# EasyEDA Pro project 4090_Portable_Fan.epro, board PCB1_3
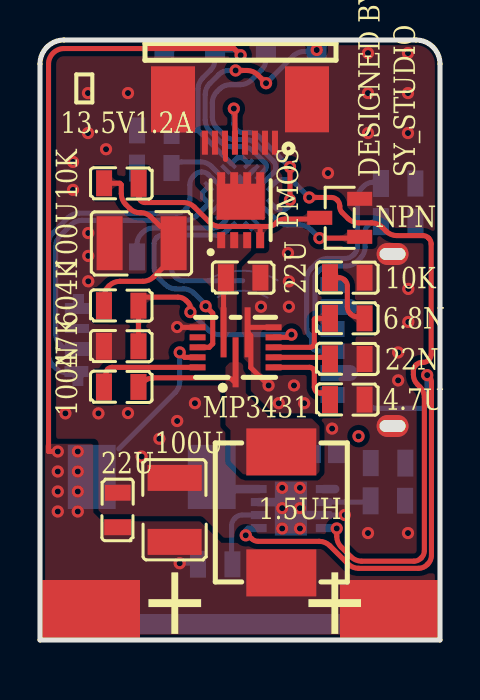
[diagram p6: board, top side]
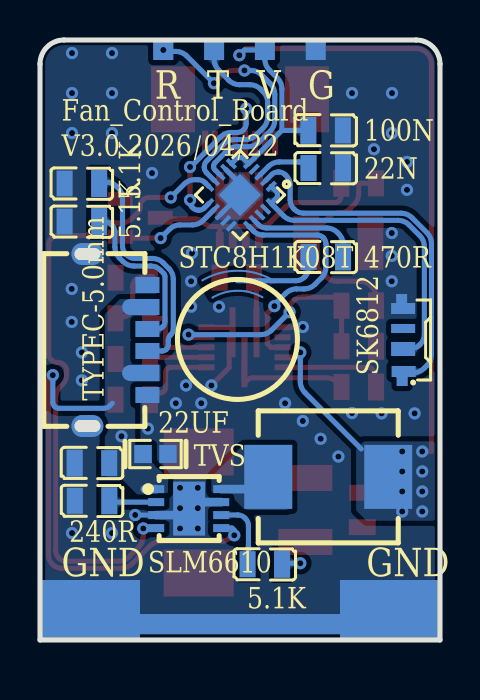
[diagram p7: board, bottom side, seen from below]

Outline 20 x 30 mm; copper layers: Top Layer, Bottom Layer. Coordinates in mm from the lower left corner of the outline.
Outline path: 0,28.8 arc(0.35,29.65) 1.2,30 18.8,30 arc(19.65,29.65) 20,28.8 20,0 0,0 0,28.8
Stack: Top Layer 0.035mm / Dielectric1 1.51mm FR4 er 4.5 / Bottom Layer 0.035mm

## Design rules (mm)
spacing copperThickness1oz (default): track to track 0.102, other pairs 0.152 to 0.3
spacing copperThickness2oz: track to track 0.203, other pairs 0.152 to 0.3
spacing Plane_innerPlane: track to track 0.102, other pairs 0.152 to 0.3
spacing Copper_copperRegion: track to track 0.102, other pairs 0.152 to 0.3
track width copperThickness1oz (default): min 0.127, default 0.254, max 2.54
track width copperThickness2oz: min 0.203, default 0.254, max 2.54
differential pair differentialPair (default): width min 0.127, default 0.254, max 2.54; gap min 0.152, default 0.152
net GND uses copperRegion_copperThickness1oz
net VBUS uses copperRegion_copperThickness1oz
net VBAT uses copperRegion_copperThickness1oz
net 13.5V uses copperRegion_copperThickness1oz
net $1N43239 uses copperRegion_copperThickness1oz
pour e97 uses Copper_copperRegion, copperRegion_Copper_copperRegion
net $1N43301 uses copperRegion_copperThickness1oz
net VFAN uses copperRegion_copperThickness1oz
pour e324 uses Copper_copperRegion, copperRegion_Copper_copperRegion
pour e327 uses Copper_copperRegion, copperRegion_Copper_copperRegion

## Placement (name value [footprint] x y rotation side)
C1  22nF  [0805_S]  5.72 23.65 90 bottom
C2  100uF  [C1210]  5.08 19.84 0 top
C3  22uF  [0805_S]  10.16 18.06 270 top
C5  100uF  [C1210]  6.73 6.5 270 top
C9  22uF  [0805_S]  17.4 8.79 270 bottom
C10  22uF  [0805_S]  3.94 6.5 0 top
C11  4.7uF  [0805_S]  15.37 11.97 270 top
C12  100nF  [0805_S]  5.72 25.43 270 bottom
C16  100nF  [0805_S]  4.06 12.6 270 top
C17  22nF  [0805_S]  15.37 14 270 top
C18  6.8nF  [0805_S]  15.37 16.03 270 top
FPC1  AFC07-S08ECA-00  [FPC-SMD_P0.5-8P_LCS-SH-H2.0]  10 25.95 0 top
L2  2.2uH  [IND-SMD_L7.0-W6.6]  5.59 8.16 180 bottom
L3  2.2uh  [IND-SMD_L7.0-W6.6_MCW-0650-220]  12.06 6.38 90 top
LED1  SK6812SIDE-A  [LED-SMD_4P-L4.0-W1.6-L]  1.83 15 90 bottom
NOREF  -  [Pad_e37]  6.22 29.5 180 top
NOREF#2  -  [Pad_e40]  13.84 29.5 180 top
NOREF#3  -  [Pad_e39]  11.29 29.5 180 top
NOREF#4  -  [Pad_e38]  8.75 29.5 180 top
NOREF#5  -  [Pad_e104]  17.5 1.5 0 top
NOREF#6  -  [Pad_e102]  17.5 1.5 0 top
NOREF#7  -  [Pad_e103]  2.5 1.5 0 top
NOREF#8  -  [Pad_e101]  2.5 1.5 0 top
Q1  ASDM30P11TD-R  [DFN-8_L3.0-W3.0-P0.65-BL]  10.03 21.49 0 top
Q2  SS8050  [SOT-23-3_L2.9-W1.3-P1.90-LS2.4-BR]  14.99 21.11 0 top
R1  10K  [0805_S]  4.06 22.89 90 top
R3  10K  [0805_S]  15.37 18.06 270 top
R4  470R  [0805_S]  5.72 19.2 90 bottom
R8  240  [0805_S]  17.4 7.01 90 bottom
R9  5.1K  [0805_S]  17.91 20.97 90 bottom
R10  5.1K  [0805_S]  8.76 3.84 90 bottom
R11  5.1K  [0805_S]  17.91 22.88 90 bottom
R14  47K  [0805_S]  4.06 14.63 270 top
R20  604K  [0805_S]  4.06 16.67 270 top
TVS1  PESD0603-240  [D0603-BI]  14.22 9.3 0 bottom
U1  -  [F9-10-6-0.4喇叭口无针触摸弹簧]  10 15 179.6 bottom
U3  MP3431GL-Z  [QFN-13_L3.0-W4.0-P0.50-BL]  9.78 14.63 90 top
U4  -  [DFN-8_L3.0-W3.0-P0.65-BL-EP_AOZ6662DI]  12.89 6.92 180 bottom
U7  STC8H1K08T-33I-QFN20  [QFN-20_L3.0-W3.0-P0.40-TL-EP1.5]  10 22.25 315 bottom
USBC1  TYPE-C 6P WTL5.0 108  [USB-C-SMD_TYPE-C-6P-WTL5.0-108]  16.13 15 270 bottom

## Footprints (pads in the part's own frame, mm; a bottom-side part is the same pattern mirrored in y, then rotated)
0805_S
  rect 1.3x0.8 smd: 1(-0.052,0.86)
  rect 1.35x0.8 smd: 2(-0.052,-0.867)
C1210
  rect 1.3x2.7 smd: 1(-1.6,0) 2(1.6,0)
D0603-BI
  rect 0.873x0.907 smd: 1(-0.622,0) 2(0.622,0)
DFN-8_L3.0-W3.0-P0.65-BL
  rect 0.4x0.8 smd: 1(-0.975,-1.5) 2(-0.325,-1.5) 3(0.325,-1.5) 4(0.975,-1.5) 5(0.975,1.5) 6(0.325,1.5) 7(-0.325,1.5) 8(-0.975,1.5)
  rect 2.4x1.8 smd: 9(0,0.425)
DFN-8_L3.0-W3.0-P0.65-BL-EP_AOZ6662DI
  rect 0.8x0.4 smd: 1(-1.3,0.622) 2(-1.3,-0.028) 3(-1.3,-0.678) 4(-1.3,-1.328) 5(1.95,-1.328) 6(1.95,-0.678) 7(1.95,-0.028) 8(1.95,0.622)
  rect 1.6x2.7 smd: 9(0.347,-0.353)
F9-10-6-0.4喇叭口无针触摸弹簧
  custom 3.5x1.335 smd: 1(-0.111,2.965)
FPC-SMD_P0.5-8P_LCS-SH-H2.0
  rect 0.3x1.2 smd: 1(1.748,-1.084) 2(1.248,-1.084) 3(0.748,-1.084) 4(0.248,-1.084) 5(-0.252,-1.084) 6(-0.752,-1.084) 7(-1.252,-1.084) 8(-1.754,-1.083)
  rect 2.2x3.3 smd: 9(3.35,1.084) 10(-3.35,1.084)
IND-SMD_L7.0-W6.6
  rect 2.4x3.2 smd: 1(-3,0) 2(3,0)
IND-SMD_L7.0-W6.6_MCW-0650-220
  rect 2.35x3.5 smd: 1(-3.025,0) 2(3.025,0)
LED-SMD_4P-L4.0-W1.6-L
  custom 1x1.2 smd: 1(-1.8,-0.013) 4(1.8,0.013)
  custom 0.7x1.2 smd: 2(-0.45,0.013)
  custom 0.45x1.2 smd: 3(0.575,0.013)
Pad_e37
  rect 1x1 smd far side: 2(0,0)
Pad_e38
  rect 1x1 smd far side: 2(0,0)
Pad_e39
  rect 1x1 smd far side: 2(0,0)
Pad_e40
  rect 1x1 smd far side: 2(0,0)
Pad_e101
  rect 5x3 smd: 22(0,0)
Pad_e102
  rect 5x3 smd: 22(0,0)
Pad_e103
  rect 5x3 smd far side: 22(0,0)
Pad_e104
  rect 5x3 smd far side: 22(0,0)
QFN-13_L3.0-W4.0-P0.50-BL
  rect 2.5x0.3 smd: 1(-0.75,0) 7(0.75,-0.6) 8(0.75,0.6)
  rect 0.3x0.8 smd: 2(-1,-1.9) 3(-0.5,-1.9) 4(0,-1.9) 5(0.5,-1.9) 6(1,-1.9) 9(1,1.9) 10(0.5,1.9) 11(0,1.9) 12(-0.5,1.9) 13(-1,1.9)
QFN-20_L3.0-W3.0-P0.40-TL-EP1.5
  rect 0.6x0.2 smd: 1(-1.407,0.8) 2(-1.407,0.4) 3(-1.407,0) 4(-1.407,-0.4) 5(-1.407,-0.8) 11(1.407,-0.8) 12(1.407,-0.4) 13(1.407,0) 14(1.407,0.4) 15(1.407,0.8)
  rect 0.2x0.6 smd: 6(-0.8,-1.407) 7(-0.4,-1.407) 8(0,-1.407) 9(0.4,-1.407) 10(0.8,-1.407) 16(0.8,1.407) 17(0.4,1.407) 18(0,1.407) 19(-0.4,1.407) 20(-0.8,1.407)
  rect 1.5x1.5 smd: 21(0,0)
SOT-23-3_L2.9-W1.3-P1.90-LS2.4-BR
  rect 1.25x0.7 smd: 1(1,-0.95) 2(1,0.95) 3(-1,0)
USB-C-SMD_TYPE-C-6P-WTL5.0-108
  oval 1.1x1.6 hole 0.6x1.3: 7(-4.3,-1.5) 8(4.3,-1.5)
  rect 0.8x1.2 smd: A5(-0.55,1.5) A9(1.65,1.5) A12(2.75,1.5) B5(0.55,1.5) B9(-1.65,1.5) B12(-2.75,1.5)

## Nets
As in the schematic, except:
GND: C1.2 C2.1 C3.1 C5.1 C9.2 C10.1 C11.1 C12.1 C17.1 FPC1.1 FPC1.2 FPC1.3 FPC1.4 FPC1.9 FPC1.10 LED1.4 NOREF.2 NOREF#5.22 NOREF#7.22 Q2.2 R3.1 R8.1 R9.1 R11.1 R14.2 TVS1.1 U3.6 U3.7 U3.9 U4.3 U4.7 U4.9 U7.7 U7.13 U7.14 U7.15 U7.21 USBC1.7 USBC1.8 USBC1.A12 USBC1.B12
VBAT: C5.2 C10.2 C12.2 L2.2 L3.1 NOREF#4.2 NOREF#6.22 NOREF#8.22 R10.2 U3.12 U7.5 U7.6
RXD: NOREF#2.2 U7.8
TXD: NOREF#3.2 U7.9

Pads without a net: LED1 3; U3 10; U7 4 18 19

## Via types
v1: diameter 0.61, hole 0.305, Top Layer to Bottom Layer, 72 vias

## Routing (per net, layer and track width the routed paths; a pad name or vN(x,y) marks a point on that pad's centre or on a via; arc(x,y) is an arc through that point)
13.5V: length 12.5
  Top Layer w0.254: R1.1 3.99,22.84 4.06,22.76 4.06,22.31 arc(4.12,22.02) 4.29,21.78 4.5,21.57 arc(4.72,21.42) 4.99,21.36 5.05,21.36 arc(5.31,21.31) 5.54,21.16 6.02,20.68 ; R20.2 3.2,17.14 arc(3.25,17.43) 3.42,17.67 3.46,17.72 arc(3.71,17.88) 3.99,17.94 5.15,17.94 arc(5.44,17.99) 5.68,18.16 6.73,19.2 arc(6.81,19.33) 6.84,19.48 6.84,19.57 arc(6.82,19.67) 6.77,19.75 C2.2 ; U3.8 9.18,18 C3.2
GND: length 27.8
  Top Layer w0.254: U3.6 10.4,15.63 10.38,15.61 U3.7 10.54,15.22 10.54,13.62 v1(11.43,12.73) ; U3.9 6.87,15.63 v1(6.86,15.65)
  Bottom Layer w0.254: v1(15.24,6.25) 14.2,6.25 U4.3 ; U7.13 U7.21 10,22.82 U7.7
  Bottom Layer w0.431: U4.3 13.07,6.25 arc(12.88,6.28) 12.72,6.39 12.36,6.75 arc(12.2,6.86) 12.01,6.89 U4.7
  Bottom Layer w1: 16.59,1.5 15.9,0.8 3.2,0.8 NOREF#7.22
  vias: v1(1.27,11.33) v1(1.65,23.9) v1(1.65,22.51) v1(2.4,27.35) v1(2.4,25.35) v1(2.41,20.35) v1(2.41,19.2) v1(2.41,17.94) v1(2.92,11.33) v1(3.3,24.54) v1(4.4,27.35) v1(4.4,11.35) v1(5.08,9.17) v1(5.97,10.06) v1(6.86,10.95) v1(7.75,11.84) v1(11.05,16.67) v1(11.94,11.84) v1(12.11,7.61) v1(12.11,6.59) v1(12.11,5.58) v1(12.4,19.35) v1(12.45,17.94) v1(12.45,16.67) v1(12.7,12.73) v1(13,7.61) v1(13,6.59) v1(13,5.58) v1(13.21,11.84) v1(14.4,23.35) v1(14.6,10.57) v1(16.4,29.35) v1(16.4,27.35) v1(16.4,25.35) v1(16.4,5.35) v1(17.91,14.38) v1(17.91,12.98) v1(18.4,29.35) v1(18.4,27.35) v1(18.4,25.35) v1(18.41,17.55) v1(18.41,15.9) v1(18.4,5.35)
VBAT: length 48.4
  Top Layer w0.254: v1(10.03,29.24) 9.7,29.57 1.2,29.57 arc(0.65,29.35) 0.43,28.8 0.43,9.43 v1(0.89,9.43) ; U3.12 7.23,14.13 v1(6.99,14.38)
  Bottom Layer w0.254: v1(6.99,14.38) 6.99,12.92 arc(6.93,12.63) 6.76,12.38 3.94,9.55 ; v1(10.03,29.24) 9.77,29.5 NOREF#4.2 8.75,29.04 arc(8.7,28.75) 8.53,28.5 8.13,28.09 arc(7.96,27.85) 7.9,27.56 7.9,25.48 ; C12.2 7.9,25.48 ; 7.9,25.48 U7.5 9.87,24.12 10.13,24.12 10.43,23.82 ; v1(6.99,3.84) 7.87,3.84
  vias: v1(0.89,8.43) v1(0.89,7.43) v1(0.89,6.43) v1(1.89,9.43) v1(1.89,8.43) v1(1.89,7.43) v1(1.89,6.43)
VBUS: length 27.1
  Top Layer w0.254: v1(19.36,13.24) 19.48,13.13 arc(19.55,13.02) 19.57,12.89 19.57,4.23 arc(19.53,4) 19.4,3.8 19.35,3.76 arc(19.16,3.63) 18.93,3.58 15.94,3.58 arc(15.65,3.64) 15.4,3.81 14.49,4.71 arc(14.25,4.88) 13.96,4.93 10.93,4.93 ; v1(10.29,5.23) 10.36,5.23 arc(10.41,5.22) 10.45,5.19 10.58,5.07 arc(10.73,4.97) 10.91,4.93
  Bottom Layer w0.254: U4.5 10.39,5.59 10.29,5.49 v1(10.29,5.23) ; v1(19.36,13.24) 19.36,11.88 arc(19.34,11.78) 19.28,11.69 19.26,11.67 arc(19.17,11.61) 19.06,11.58 16.8,11.58 arc(16.65,11.61) 16.52,11.7 16.38,11.84
  Bottom Layer w0.431: U4.1 14.76,7.55
  Bottom Layer w0.8: USBC1.B9 15.49,16.65 ; USBC1.A9 15.49,13.35
  vias: v1(15.93,10.19)
CHRG: length 32
  Top Layer w0.254: v1(13.46,22.13) 14.57,22.13 arc(14.72,22.1) 14.85,22.01 14.87,21.99 arc(14.96,21.86) 14.99,21.71 14.99,21.66 arc(15.02,21.5) 15.11,21.37 15.4,21.08 arc(15.65,20.91) 15.94,20.86 16.58,20.86 arc(16.87,20.8) 17.11,20.63 17.3,20.44 arc(17.55,20.28) 17.84,20.22 19.14,20.22 arc(19.29,20.19) 19.42,20.11 19.44,20.08 arc(19.53,19.95) 19.56,19.81 19.56,14.28 arc(19.53,14.14) 19.45,14.02 19.42,13.99 arc(19.3,13.91) 19.16,13.88 19.1,13.88 arc(18.95,13.85) 18.81,13.76 18.79,13.74 arc(18.7,13.6) 18.67,13.45 18.67,13.27 arc(18.72,13) 18.87,12.78 18.99,12.66 arc(19.16,12.41) 19.22,12.12 19.22,4.46 arc(19.18,4.27) 19.07,4.12 19.04,4.08 arc(18.88,3.98) 18.69,3.94 16.08,3.94 arc(15.79,4) 15.55,4.16 15.06,4.65 arc(14.89,4.9) 14.84,5.19 v1(14.84,5.58)
  Bottom Layer w0.254: 13.34,22 13.34,22.14 arc(13.31,22.24) 13.25,22.33 12.79,22.8 arc(12.55,22.96) 12.27,23.02 12.1,23.02 arc(11.91,22.98) 11.74,22.87 U7.10 ; U4.4 14.21,5.58 v1(14.84,5.58)
EN: length 11.8
  Top Layer w0.254: U3.11 8.46,14.63 8.64,14.81 8.64,16.34 v1(8.28,16.69)
  Bottom Layer w0.254: U7.16 9.32,20.45 arc(9.1,20.3) 8.84,20.25 6.14,20.25 arc(5.98,20.21) 5.85,20.13 5.82,20.1 arc(5.73,19.97) 5.7,19.81 5.7,18.64 arc(5.76,18.35) 5.93,18.11 6.25,17.78 arc(6.5,17.61) 6.79,17.55 7.18,17.55 arc(7.47,17.5) 7.72,17.33 8.28,16.77 v1(8.28,16.69)
PWM: length 9.3
  Top Layer w0.254: v1(9.69,26.57) 9.75,26.51 FPC1.5 ; v1(12.5,22) v1(12.5,23.65)
  Bottom Layer w0.254: U7.11 11.78,21.6 arc(11.91,21.52) 12.05,21.49 12.09,21.49 arc(12.23,21.52) 12.36,21.6 12.42,21.66 arc(12.48,21.75) 12.5,21.86 v1(12.5,22) ; v1(12.5,23.65) 12.47,23.65 10.97,25.16 arc(10.72,25.32) 10.43,25.38 10.12,25.38 arc(9.97,25.41) 9.84,25.5 9.81,25.52 arc(9.72,25.66) 9.69,25.81 v1(9.69,26.57)
PWR_CTRL: length 5.3
  Top Layer w0.254: Q2.1 15.92,20.09 v1(13.97,20.09)
  Bottom Layer w0.254: U7.12 11.84,20.98 arc(12.09,20.81) 12.38,20.75 12.99,20.75 arc(13.29,20.7) 13.53,20.53 v1(13.97,20.09)
RXD: length 13.1
  Top Layer w0.254: v1(11.3,27.84) 10.89,28.25 arc(10.64,28.42) 10.35,28.48 v1(9.78,28.48)
  Bottom Layer w0.254: v1(9.78,28.48) 9.43,28.48 arc(9.17,28.42) 8.94,28.27 8.48,27.82 arc(8.32,27.57) 8.26,27.28 8.26,25.99 arc(8.32,25.7) 8.48,25.45 9.05,24.89 arc(9.3,24.72) 9.59,24.67 10.13,24.67 arc(10.42,24.61) 10.67,24.44 11.25,23.86 arc(11.3,23.79) 11.32,23.69 11.32,23.67 arc(11.3,23.58) 11.25,23.5 U7.8 ; v1(11.3,27.84) 12.67,29.21 arc(12.91,29.37) 13.21,29.43 13.76,29.43 v1(13.84,29.5)
TXD: length 10.3
  Bottom Layer w0.254: NOREF#3.2 11.29,29.04 arc(11.24,28.75) 11.07,28.5 10.56,27.99 arc(10.31,27.82) 10.02,27.77 9.51,27.77 arc(9.22,27.71) 8.97,27.54 8.84,27.41 arc(8.67,27.16) 8.62,26.87 8.62,26.14 arc(8.67,25.85) 8.84,25.61 9.2,25.25 arc(9.45,25.08) 9.74,25.02 10.28,25.02 arc(10.57,24.96) 10.82,24.8 11.67,23.95 arc(11.76,23.82) 11.78,23.67 11.78,23.63 arc(11.76,23.48) 11.67,23.36 U7.9
VFAN: length 0.8
  Top Layer w0.254: FPC1.6 9.27,24.84 9.27,24.03
WS2812_PWR: length 15.9
  Bottom Layer w0.254: 2.1,14.55 1.51,14.55 arc(1.25,14.6) 1.03,14.75 0.98,14.79 arc(0.83,15.01) 0.78,15.28 0.78,19.67 arc(0.84,19.96) 1.01,20.21 1.56,20.76 arc(1.8,20.93) 2.09,20.98 7.28,20.98 arc(7.57,21.04) 7.82,21.21 U7.20 8.13,22.13 8.13,22.37 U7.1
WS2812_SPI: length 18.5
  Bottom Layer w0.254: U7.2 8.42,23.27 arc(8.27,23.37) 8.1,23.4 8.06,23.4 arc(7.89,23.37) 7.75,23.27 7.67,23.19 arc(7.54,23) 7.49,22.77 7.49,22 arc(7.45,21.76) 7.31,21.56 7.27,21.52 arc(7.07,21.39) 6.83,21.34 1.94,21.34 arc(1.65,21.28) 1.4,21.12 0.65,20.36 arc(0.49,20.12) 0.43,19.82 0.43,14.27 arc(0.48,13.98) 0.65,13.73 0.79,13.59 arc(1.04,13.42) 1.33,13.36 1.81,13.36 arc(1.9,13.34) 1.98,13.29 2.07,13.2
$1N19622: length 8.4
  Bottom Layer w0.254: R9.2 16.78,20.92 arc(16.59,20.88) 16.43,20.78 16.4,20.75 arc(16.29,20.59) 16.26,20.4 16.26,19.65 arc(16.2,19.36) 16.03,19.11 15.84,18.92 arc(15.6,18.75) 15.31,18.7 14.46,18.7 arc(14.2,18.65) 13.99,18.5 13.81,18.32 arc(13.77,18.26) 13.75,18.19 13.75,15.92 arc(13.78,15.79) 13.85,15.67 13.88,15.65 arc(13.99,15.58) 14.12,15.55 USBC1.A5
$1N19624: length 12
  Bottom Layer w0.254: R11.2 16.98,22.89 16.65,22.89 arc(16.4,22.84) 16.19,22.7 16.1,22.6 arc(15.93,22.36) 15.88,22.06 15.88,19.7 arc(15.83,19.48) 15.7,19.29 15.67,19.25 arc(15.48,19.12) 15.25,19.08 14.38,19.08 arc(14.08,19.02) 13.84,18.86 13.56,18.58 arc(13.39,18.33) 13.34,18.04 13.34,15.56 arc(13.36,15.41) 13.45,15.28 13.47,15.26 arc(13.56,15.13) 13.59,14.98 13.59,14.75 arc(13.61,14.64) 13.67,14.55 13.69,14.53 arc(13.78,14.47) 13.89,14.45 USBC1.B5
$1N43229: length 10.8
  Top Layer w0.254: 11.01,20.68 Q1.4 ; 11.01,20.68 9,20.68 arc(8.71,20.73) 8.47,20.9 7.72,21.65 arc(7.47,21.81) 7.18,21.87 5.25,21.87 arc(5.14,21.89) 5.05,21.95 5.03,21.97 arc(4.97,22.06) 4.95,22.17 4.95,22.81 4.93,22.84 ; 11.01,20.68 11.4,20.68 arc(11.61,20.72) 11.8,20.84 11.84,20.88 arc(12.02,21) 12.24,21.05 13.72,21.05
$1N43235: length 3.3
  Bottom Layer w0.254: U4.6 10.93,6.25 10.12,6.25 arc(9.92,6.21) 9.76,6.1 9.73,6.07 arc(9.62,5.91) 9.58,5.71 9.58,4.06
$1N43239: length 2.6
  Bottom Layer w0.431: U4.8 9.59,7.55 arc(9.23,7.62) 8.92,7.82 L2.1
$1N43243: length 2.4
  Bottom Layer w0.254: R8.2 16.47,6.89 U4.2
$1N43289: length 2.8
  Bottom Layer w0.254: C1.1 6.74,23.77 arc(6.9,23.87) 7.08,23.9 8.03,23.9 arc(8.32,23.85) 8.57,23.68 U7.3
$1N43298: length 4
  Top Layer w0.254: C11.2 14.26,12.26 arc(14.16,12.32) 14.05,12.35 14.01,12.35 arc(13.9,12.37) 13.81,12.43 13.8,12.45 arc(13.74,12.54) 13.72,12.64 13.72,13.4 arc(13.7,13.48) 13.65,13.55 13.64,13.57 arc(13.57,13.62) 13.48,13.63 U3.2
$1N43300: length 5.5
  Top Layer w0.254: C16.2 3.25,12.71 arc(3.29,12.76) 3.3,12.83 3.3,13.34 arc(3.32,13.44) 3.38,13.53 3.4,13.55 arc(3.49,13.61) 3.6,13.63 U3.13
$1N43301: length 6.1
  Top Layer w0.254: U3.1 9.78,12.86 9.64,12.99 arc(9.51,13.08) 9.36,13.11 5.67,13.11 arc(5.4,13.06) 5.17,12.9 C16.1
$1N43302: length 2.8
  Top Layer w0.254: 14.43,14.05 14.38,14.1 arc(14.34,14.12) 14.29,14.13 U3.3
$1N43303: length 4.1
  Top Layer w0.254: C18.2 13.77,16.08 13.72,16.03 13.72,14.84 arc(13.7,14.77) 13.66,14.7 13.65,14.69 arc(13.58,14.65) 13.51,14.63 U3.4
$1N43304: length 3.3
  Top Layer w0.254: C18.1 16.15,16.16 15.87,16.16 arc(15.69,16.19) 15.54,16.3 15.5,16.33 arc(15.4,16.48) 15.37,16.66 15.37,17.7 arc(15.34,17.85) 15.25,17.97 15.23,18 arc(15.1,18.08) 14.95,18.11 R3.2
$1N43305: length 11.9
  Top Layer w0.254: U3.5 12.44,15.13 v1(12.57,15.27) ; v1(7.52,16.4) 7.52,16.6 arc(7.49,16.75) 7.4,16.88 7.31,16.97 arc(7.12,17.1) 6.9,17.14 5.18,17.14 arc(5.09,17.13) 5.01,17.07 4.99,17.06 arc(4.94,16.98) 4.92,16.89 R20.1 R14.1
  Bottom Layer w0.254: v1(7.52,16.4) 8.42,15.49 arc(8.67,15.33) 8.96,15.27 v1(12.57,15.27)
$1N43333: length 5.4
  Bottom Layer w0.254: 9.29,20.97 9.08,20.77 arc(8.9,20.65) 8.68,20.6 5.67,20.6 arc(5.38,20.54) 5.13,20.38 5.07,20.31 arc(4.9,20.07) 4.85,19.78 4.85,19.41
$1N43334: length 4.7
  Bottom Layer w0.254: 6.58,19.41 6.58,18.59 arc(6.62,18.36) 6.75,18.17 6.78,18.14 arc(6.97,18.01) 7.2,17.96 U1.1

## Copper pours and planes (outline as drawn; the poured copper is in the pictures)
13.5V on Top Layer: 8.93,15.14 8.93,15.86 8.89,15.9 8.89,17.31 8.14,18.06 5.95,18.06 5.59,18.42 5.59,20.98 5.98,21.37 7.54,21.37 7.93,20.97 10.34,20.97 10.7,20.61 10.7,19.62 9.83,18.75 9.83,15.14
GND on Top Layer: 0,30 20,30 20,0 0,0
GND on Bottom Layer: 0,30 20,30 20,0 0,0
VBAT on Top Layer: 2.67,9.81 2.67,6.38 3.13,5.92 5.03,5.92 4.44,5.34 4.44,1.42 1.22,1.42 0,2.65 0,9.55 0.25,9.81
VBAT on Top Layer: 0,3.11 2.41,3.11 4.15,4.86 4.15,5.45 4.63,5.93 8,5.93 9.08,4.86 13.97,4.86 15.49,3.33 20,3.33 20,0 0,0
VBAT on Bottom Layer: 0.13,9.93 3.81,9.93 4.19,9.55 4.19,6.48 3.68,5.97 0.08,5.97 0.08,9.88
VBUS on Bottom Layer: 13.97,17.05 16,17.05 16.76,16.28 16.76,8.28 16.64,8.16 16.02,8.16 15.13,7.27 13.72,7.27 13.59,7.39 13.59,8.07 15.24,9.72 15.24,12.88 14.07,12.88 13.97,12.98 13.97,13.74 14.03,13.8 15.4,13.8 15.4,16 15.37,16.03 14.1,16.03 13.97,16.16
VFAN on Top Layer: 11.28,23.67 11.28,20.95 8.72,20.95 8.4,21.27 8.4,22.42 8,22.82 8,25.43 9.53,25.43 9.53,24.03 9.78,23.78 11.18,23.78
$1N43239 on Bottom Layer: 9.9,9.69 11.43,8.16 11.43,7.39 11.18,7.14 10.39,7.14 9.76,6.5 7.64,6.5 7.49,6.66 7.49,9.69
$1N43301 on Top Layer: 9.5,13.88 10.02,13.88 10.29,13.62 10.29,12.35 11.56,11.08 13.59,11.08 13.97,10.7 13.97,8.41 13.84,8.28 10.16,8.28 9.53,8.92 9.53,10.49 9.27,10.74 9.27,13.66

Small or netless copper shapes (teardrops, artwork), in the pictures only: 38 on Top Layer, 37 on Bottom Layer

## Text on the board
Bottom Silkscreen Layer: SK6812 | 5.1K | TYPEC-5.0mm | 100N | 22N | 470R | TVS | STC8H1K08T | 22UF | SLM6610 | 240R | Fan_Control_Board / V3.0 2026/04/22 | GND | G | V | T | R
Top Silkscreen Layer: 13.5V1.2A | 22U | 100U | MP3431 | 1.5UH | NPN | 6.8N | 4.7U | 10K | 22N | 604K | 47K | 100N | PMOS | DESIGNED BY / SY_STUDIO | + | ①
